# EasyEDA Pro project transboardv2.0.epro

# Board transboardv2.0
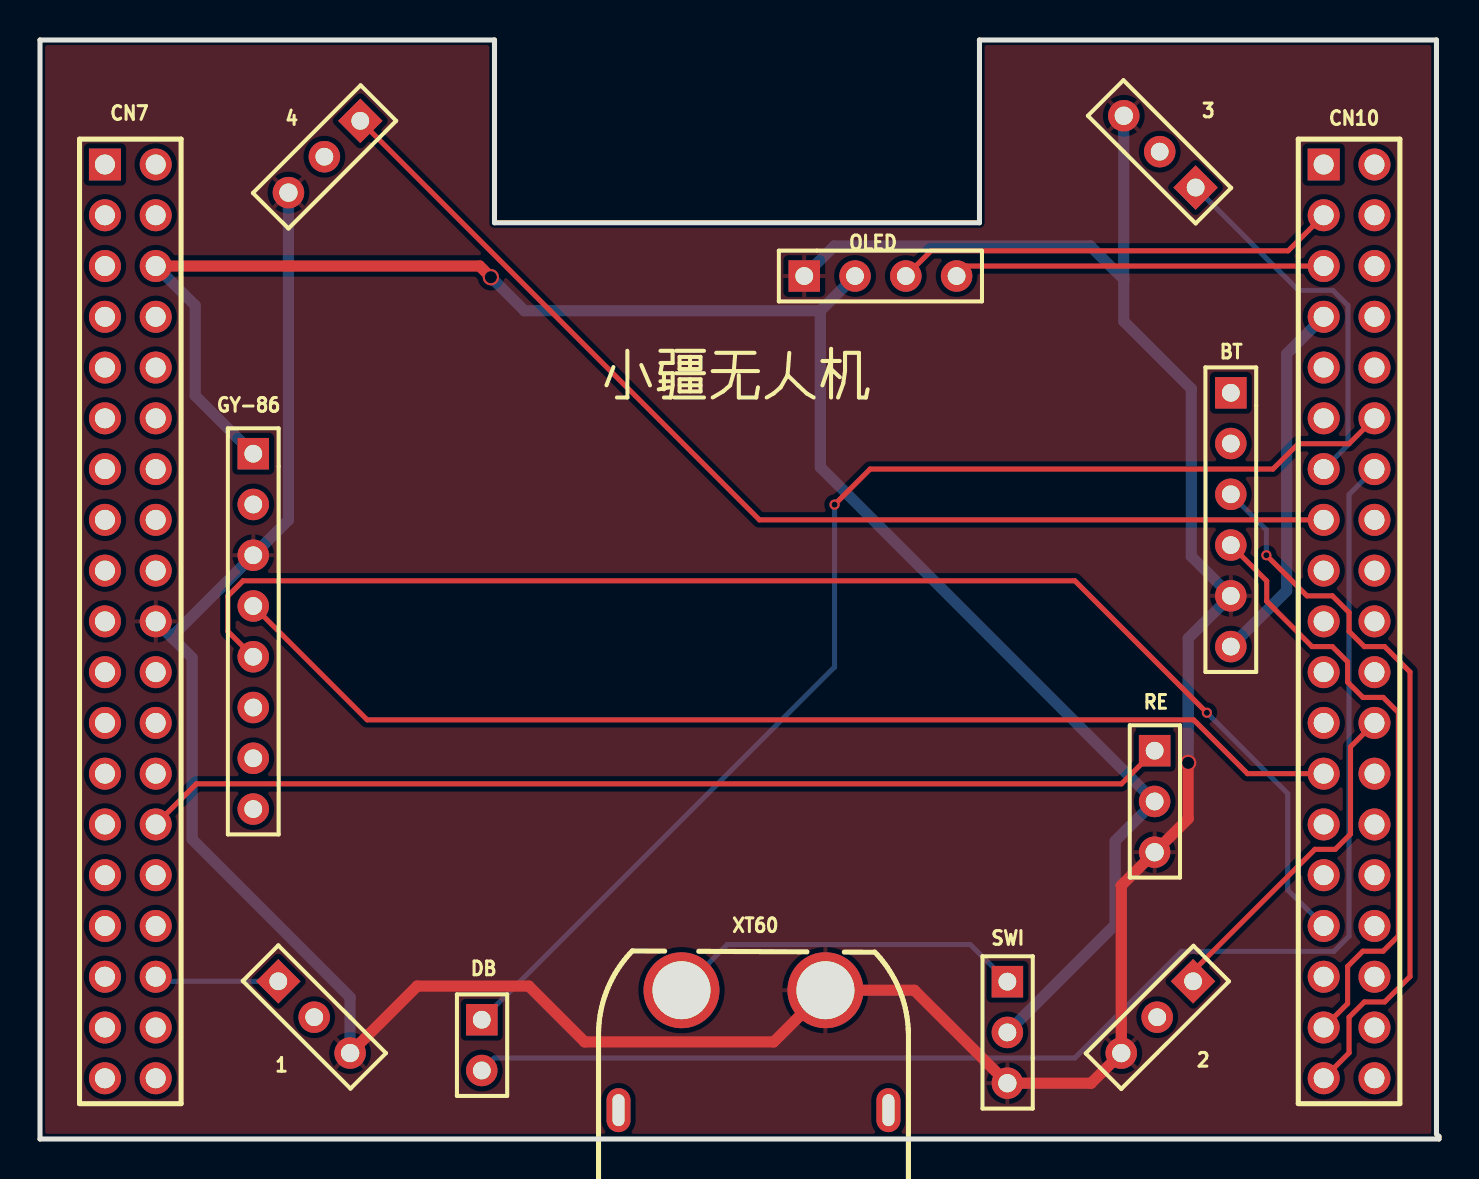
[diagram p0: board, top side]
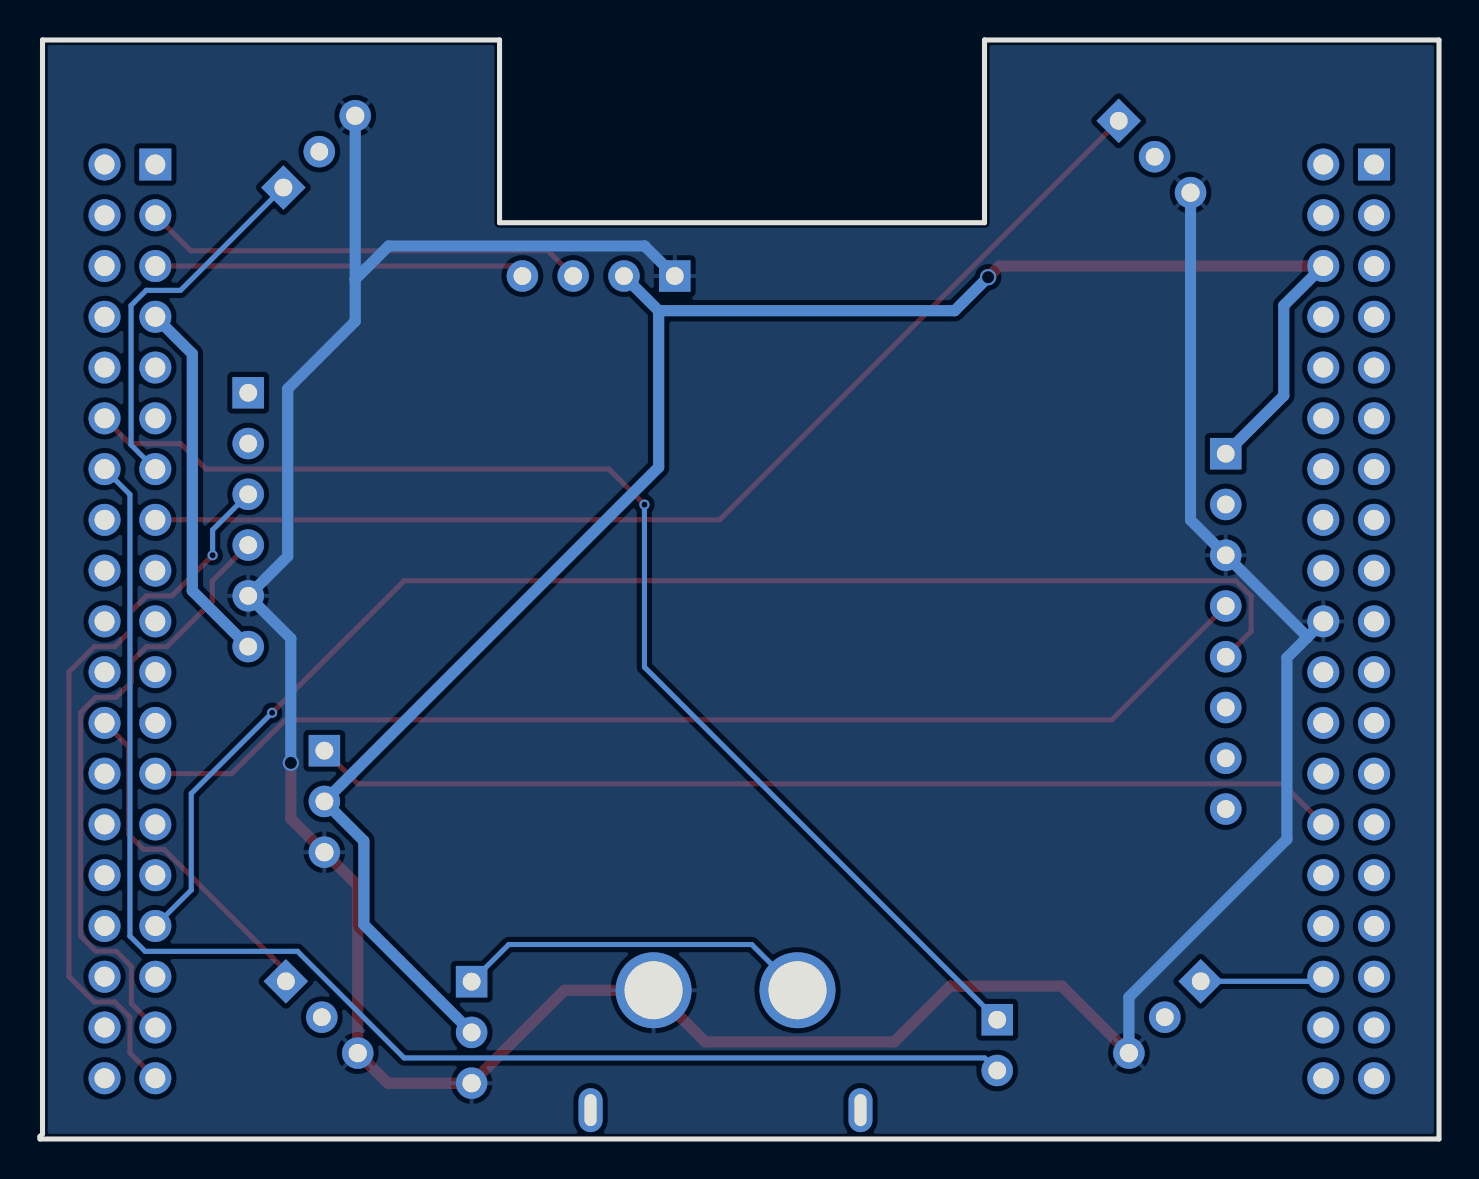
[diagram p1: board, bottom side, seen from below]

Outline 69.98 x 54.99 mm; copper layers: Top Layer, Bottom Layer. Coordinates in mm from the lower left corner of the outline.
Outline path: 0,54.99 0,0 69.98,0 69.98,0.13 69.85,0.25 69.85,54.99 46.99,54.99 46.99,45.85 22.73,45.85 22.73,54.99 0,54.99
Stack: Top Layer 0.035mm / Dielectric1 1.51mm FR4 er 4.5 / Bottom Layer 0.035mm

## Design rules (mm)
template: 自定义配置
spacing copperThickness1oz (default): track to track 0.254, other pairs 0.152 to 0.3
spacing copperThickness2oz: track to track 0.254, other pairs 0.152 to 0.3
track width copperThickness1oz (default): min 0.127, default 0.254, max 2.54
track width copperThickness2oz: min 0.203, default 0.559, max 2.54
differential pair differentialPair (default): width min 0.127, default 0.254, max 2.54; gap min 0.152, default 0.152
via viaSize (default): diameter min 0.5, default 0.508, max 10; hole min 0.3, default 0.305, max 6.299
via viaSize2: diameter min 0.5, default 0.813, max 10; hole min 0.3, default 0.61, max 6.299
net GND uses copperThickness2oz, viaSize2
net 3V3 uses copperThickness2oz, viaSize2
net 5V uses copperThickness2oz, viaSize2

## Placement (name value [footprint] x y rotation side)
1  MOTOR  [HDR-F-2.54_1X3]  13.72 6.1 315 top
2  MOTOR  [HDR-F-2.54_1X3]  55.88 6.1 225 top
3  MOTOR  [HDR-F-2.54_1X3]  56.01 49.4 135 top
4  MOTOR  [HDR-F-2.54_1X3]  14.22 49.15 225 top
BT  Bluetooth  [HDR-F-2.54_1X6]  59.56 32.26 270 top
CN7  CN7  [HDR-TH_38P-P2.54-V-F-R2-C19-S2.54]  4.52 25.9 270 top
CN10  CN10  [HDR-TH_38P-P2.54-V-F-R2-C19-S2.54]  65.48 25.9 270 top
DB  Debug  [HDR-F-2.54_1X2]  22.1 4.7 270 top
GY-86  GY-86  [HDR-F-2.54_1X8]  10.67 26.67 270 top
OLED  OLED  [HDR-F-2.54_1X4]  42.04 43.18 0 top
RE  RECEIVE  [HDR-F-2.54_1X3]  55.75 16.89 270 top
SWI  SWITCH  [HDR-F-2.54_1X3]  48.39 5.33 270 top
XT60  XT60PW-M  [CONN-TH_XT60PW-M]  35.69 4.44 90 top

## Footprints (pads in the part's own frame, mm; a bottom-side part is the same pattern mirrored in y, then rotated)
CONN-TH_XT60PW-M
  round 3.8 hole 2.9: 1(3,-3.6) 2(3,3.6)
  oval 2.2x1.2 hole 1.6x0.6: 3(-3,6.75) 4(-3,-6.75)
HDR-F-2.54_1X2
  rect 1.575x1.575 hole 0.889: 1(-1.27,0)
  round 1.575 hole 0.889: 2(1.27,0)
HDR-F-2.54_1X3
  rect 1.575x1.575 hole 0.889: 1(-2.54,0)
  round 1.575 hole 0.889: 2(0,0)
  round 1.575 hole 0.914: 3(2.54,0)
HDR-F-2.54_1X4
  rect 1.575x1.575 hole 0.889: 1(-3.81,0)
  round 1.575 hole 0.889: 2(-1.27,0) 3(1.27,0) 4(3.81,0)
HDR-F-2.54_1X6
  rect 1.575x1.575 hole 0.889: 1(-5.08,0)
  round 1.575 hole 0.889: 2(-2.54,0) 3(0,0) 4(2.54,0) 5(5.08,0) 6(7.62,0)
HDR-F-2.54_1X8
  rect 1.575x1.575 hole 0.889: 1(-7.62,0)
  round 1.575 hole 0.889: 2(-5.08,0) 3(-2.54,0) 4(0,0) 5(2.54,0) 6(5.08,0) 7(7.62,0) 8(10.16,0)
HDR-TH_38P-P2.54-V-F-R2-C19-S2.54
  rect 1.6x1.6 hole 1: 1(-22.86,-1.27)
  round 1.6 hole 1: 2(-22.86,1.27) 3(-20.32,-1.27) 4(-20.32,1.27) 5(-17.78,-1.27) 6(-17.78,1.27) 7(-15.24,-1.27) 8(-15.24,1.27) 9(-12.7,-1.27) 10(-12.7,1.27) 11(-10.16,-1.27) 12(-10.16,1.27) 13(-7.62,-1.27) 14(-7.62,1.27) 15(-5.08,-1.27) 16(-5.08,1.27) 17(-2.54,-1.27) 18(-2.54,1.27) 19(0,-1.27) 20(0,1.27) 21(2.54,-1.27) 22(2.54,1.27) 23(5.08,-1.27) 24(5.08,1.27) 25(7.62,-1.27) 26(7.62,1.27) 27(10.16,-1.27) 28(10.16,1.27) 29(12.7,-1.27) 30(12.7,1.27) 31(15.24,-1.27) 32(15.24,1.27) 33(17.78,-1.27) 34(17.78,1.27) 35(20.32,-1.27) 36(20.32,1.27) 37(22.86,-1.27) 38(22.86,1.27)

## Nets
3V3: BT.6 CN10.7
5V: CN7.6 GY-86.1 OLED.2 RE.2 SWI.2
GND: 1.3 2.3 3.3 4.3 BT.5 CN7.20 GY-86.3 OLED.1 RE.3 SWI.3 XT60.1
P: SWI.1 XT60.2
PA0: CN7.28 RE.1
PA2: BT.4 CN10.35
PA3: BT.3 CN10.37
PA6: 3.1 CN10.13
PA7: 4.1 CN10.15
PA11: CN10.14 DB.2
PA12: CN10.12 DB.1
PB0: 1.1 CN7.34
PB1: 2.1 CN10.24
PB3: CN10.31 GY-86.5
PB8: CN10.3 OLED.3
PB9: CN10.5 OLED.4
PB10: CN10.25 GY-86.4

Pads without a net: 1 2; 2 2; 3 2; 4 2; BT 1 2; CN7 1 2 3 4 5 7 8 9 10 11 12 13 14 15 16 17 18 19 21 22 23 24 25 26 27 29 30 31 32 33 35 36 37 38; CN10 1 2 4 6 8 9 10 11 16 17 18 19 20 21 22 23 26 27 28 29 30 32 33 34 36 38; GY-86 2 6 7 8; XT60 3 4

## Via types
v1: diameter 0.813, hole 0.61, Top Layer to Bottom Layer, 2 vias
v2: diameter 0.508, hole 0.305, Top Layer to Bottom Layer, 3 vias

## Routing (per net, layer and track width the routed paths; a pad name or vN(x,y) marks a point on that pad's centre or on a via; arc(x,y) is an arc through that point)
3V3: length 18.4
  Bottom Layer w0.559: CN10.7 62.36,39.29 62.36,27.43 BT.6
5V: length 94.1
  Top Layer w0.559: CN7.6 21.99,43.68 v1(22.55,43.12)
  Bottom Layer w0.559: 39.03,41.44 24.23,41.44 v1(22.55,43.12) ; 39.03,41.44 39.03,33.61 RE.2 53.78,14.92 53.78,10.72 SWI.2 ; 39.03,41.44 OLED.2 ; GY-86.1 7.76,37.19 7.76,41.7 CN7.6
GND: length 163.7
  Top Layer w0.559: 1.3 18.87,7.65 24.45,7.65 27.25,4.86 36.7,4.86 XT60.1 43.74,7.44 SWI.3 52.58,2.79 2.3 54.08,12.68 RE.3 57.43,16.03 v1(57.43,18.82)
  Bottom Layer w0.559: 6.62,25.07 CN7.20 ; 6.62,25.07 6.62,25.16 GY-86.3 12.43,30.97 4.3 ; 6.62,25.07 7.61,24.08 7.61,15 15.51,7.09 1.3 ; 54.21,43.01 54.21,40.91 57.59,37.54 57.59,29.15 BT.5 57.43,25.04 v1(57.43,18.82) ; 54.21,43.01 54.21,51.2 ; 54.21,43.01 52.53,44.68 39.73,44.68 OLED.1
P: length 18
  Bottom Layer w0.254: XT60.2 34.37,9.73 46.53,9.73 SWI.1
PA0: length 51.5
  Top Layer w0.254: RE.1 54.09,17.77 7.82,17.77 CN7.28
PA2: length 30.9
  Top Layer w0.254: CN10.35 65.41,6.78 65.41,8.64 66.17,9.4 67.18,9.4 67.94,10.16 67.94,21.34 67.18,22.1 66.17,22.1 65.41,22.86 65.41,23.88 64.64,24.64 63.63,24.64 61.36,26.91 61.36,27.92 BT.4
PA3: length 36.7
  Top Layer w0.254: v2(61.34,29.21) 63.37,27.18 64.64,27.18 65.48,26.34 65.48,25.4 66.24,24.64 67.26,24.64 68.53,23.37 68.53,8.13 67.26,6.86 66.24,6.86 65.48,6.1 65.48,4.31 CN10.37
  Bottom Layer w0.254: v2(61.34,29.21) 61.34,30.48 BT.3
PA6: length 18.8
  Bottom Layer w0.254: 57.8,47.61 62.94,42.47 64.66,42.47 65.42,41.7 65.42,34.73 CN10.13
PA7: length 56.5
  Top Layer w0.254: CN10.15 35.99,30.98 16.02,50.94
PA11: length 70.1
  Bottom Layer w0.254: DB.2 22.72,4.06 51.76,4.06 57.1,9.39 64.72,9.39 65.48,10.15 65.48,32.25 CN10.14
PA12: length 61.9
  Top Layer w0.254: v2(39.74,31.74) 41.52,33.52 61.67,33.52 62.94,34.79 65.48,34.79 CN10.12
  Bottom Layer w0.254: v2(39.74,31.74) 39.74,23.61 DB.1
PB0: length 6.2
  Bottom Layer w0.254: CN7.34 6.02,7.89 1.1
PB1: length 17.3
  Top Layer w0.254: CN10.24 65.55,19.62 65.55,15.26 64.79,14.5 63.77,14.5 57.68,8.4 2.1
PB3: length 68.7
  Top Layer w0.254: v2(58.37,21.33) 51.76,27.93 10.16,27.93 9.4,27.17 9.4,25.4 GY-86.5
  Bottom Layer w0.254: v2(58.37,21.33) 62.41,17.28 62.41,12.46 CN10.31
PB8: length 22.2
  Top Layer w0.254: OLED.3 44.57,44.44 62.43,44.44 CN10.3
PB9: length 18.6
  Top Layer w0.254: OLED.4 46.35,43.68 CN10.5
PB10: length 57
  Top Layer w0.254: CN10.25 60.4,18.28 57.7,20.97 16.36,20.97 GY-86.4

## Copper pours and planes (outline as drawn; the poured copper is in the pictures)
GND on Top Layer: 0,54.99 22.61,54.99 22.73,54.86 22.73,45.85 46.99,45.85 46.99,54.99 47.12,55.12 69.85,55.12 69.85,0 69.72,-0.13 0,-0.13 0,54.74 0.13,54.86
GND on Bottom Layer: 0,54.99 22.73,54.99 22.73,46.1 22.86,45.97 46.99,45.97 46.99,54.86 47.12,54.99 69.85,54.99 69.85,0 0,0 -0.13,0.13 -0.13,54.86

## Text on the board
Top Silkscreen Layer: 小疆无人机
